# Altium schematic sheet Power.SchDoc
size A3; SheetNumber: 1; SheetTotal: 5
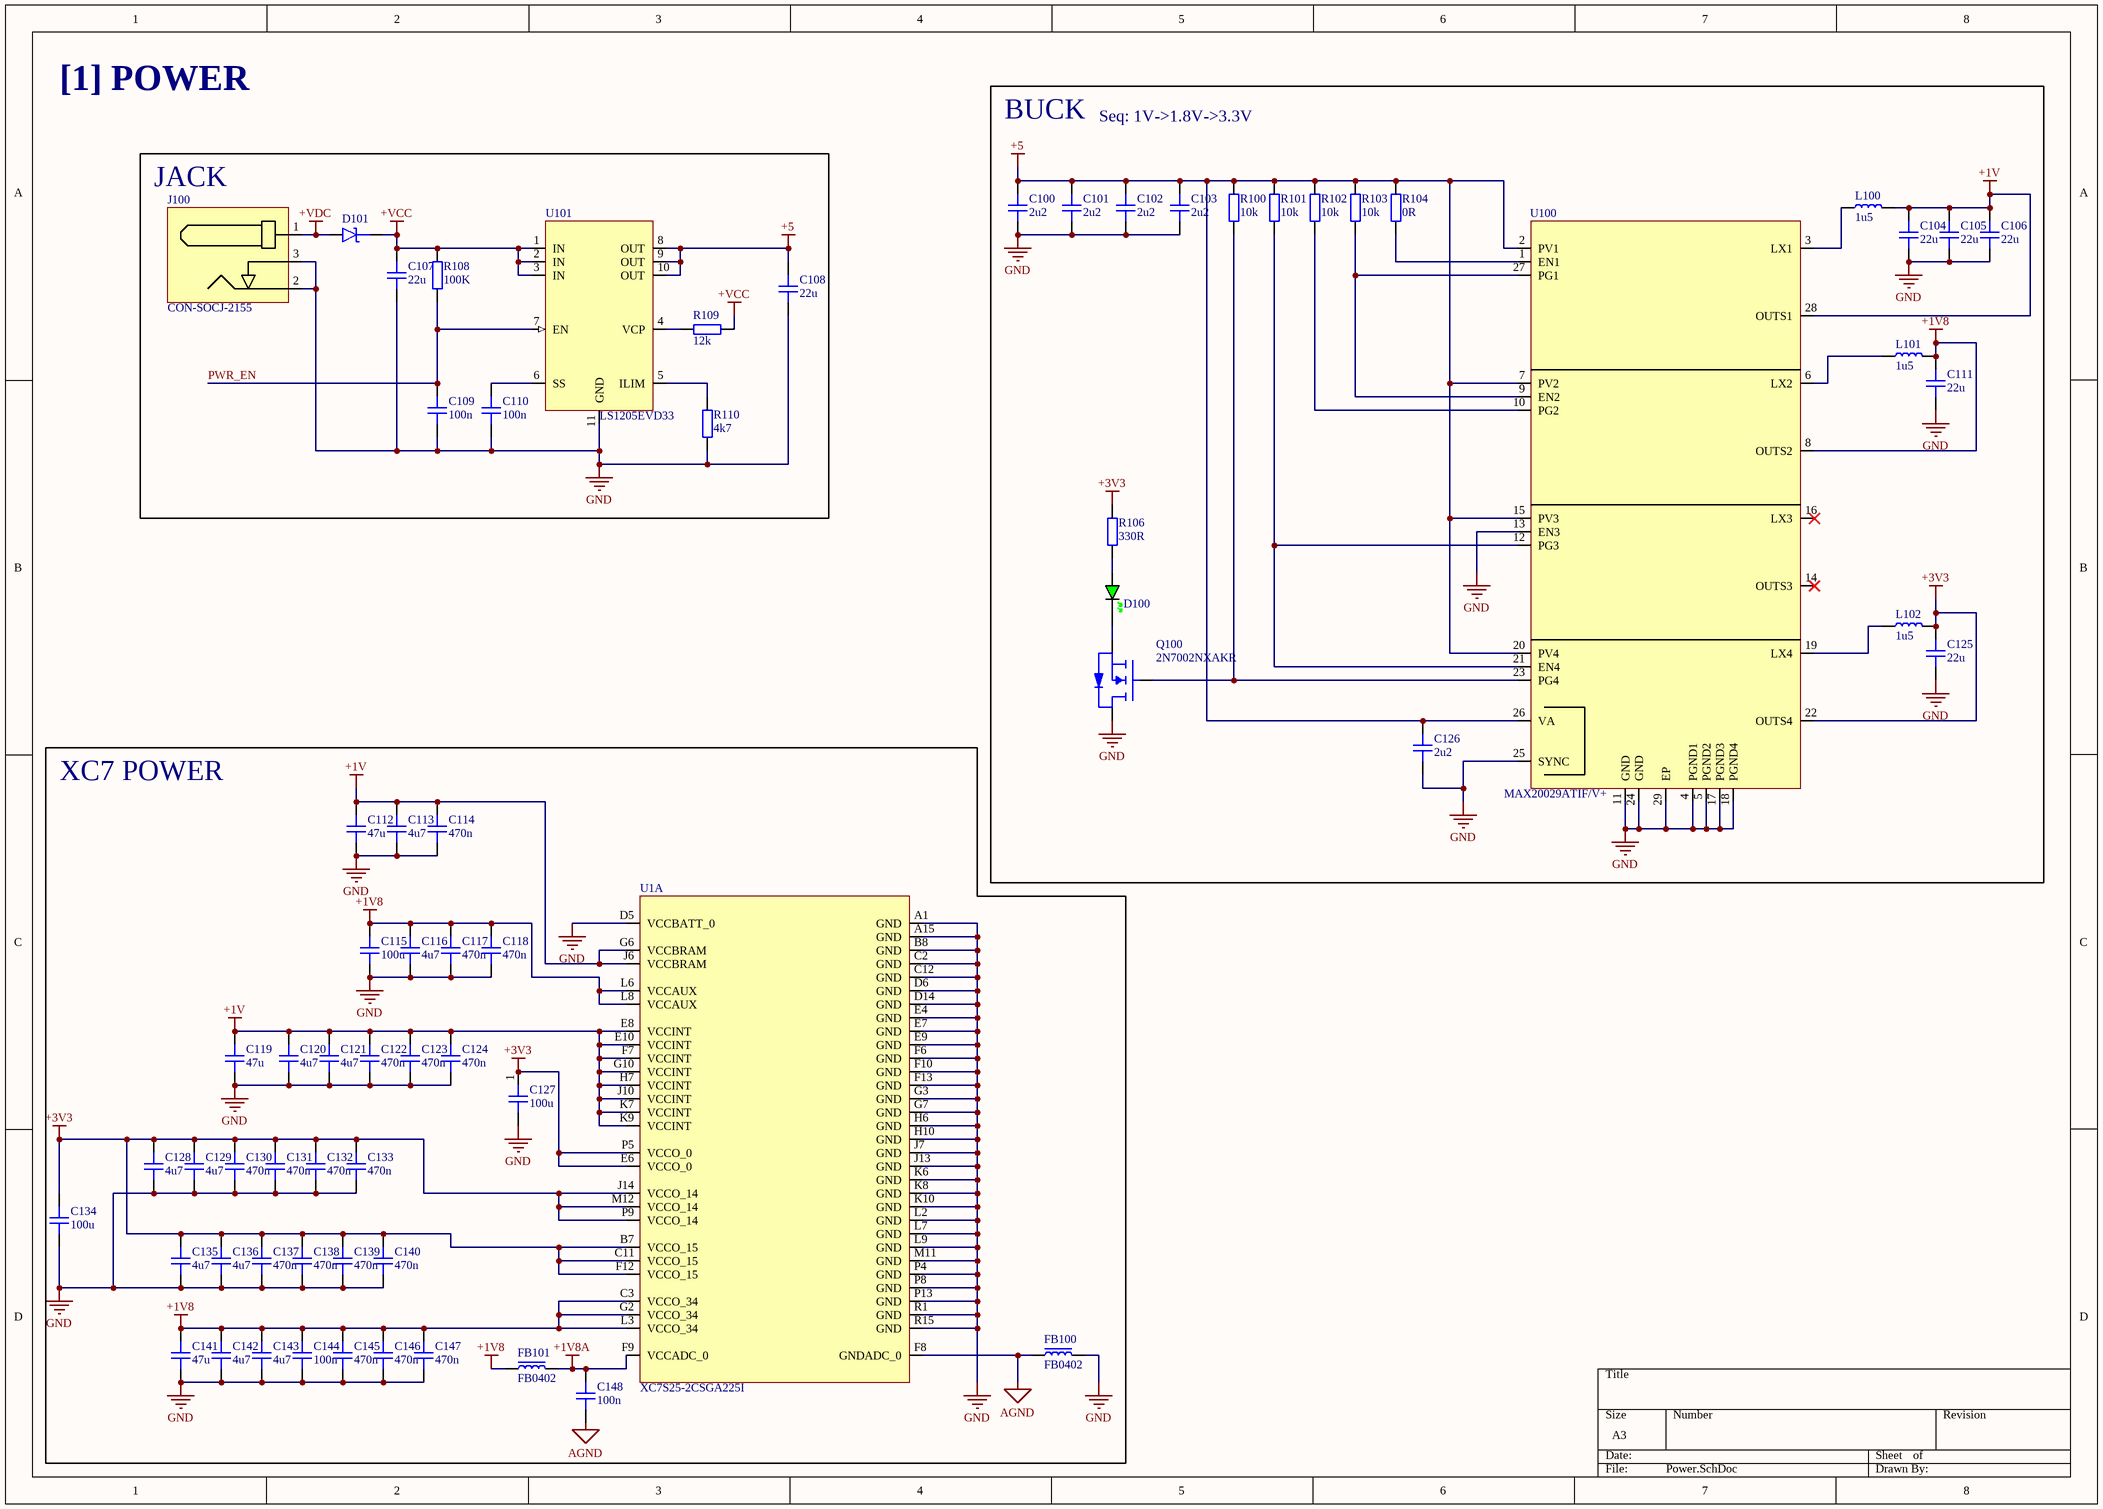
[diagram p0: Power.SchDoc]

## Parts
C100  2u2  [CAP_0603]
C101  2u2  [CAP_0603]
C102  2u2  [CAP_0603]
C103  2u2  [CAP_0603]
C104  22u  [CAP_0402]
C105  22u  [CAP_0402]
C106  22u  [CAP_0402]
C107  22u  [CAP_0402]
C108  22u  [CAP_0402]
C109  100n  [CAP_0402]
C110  100n  [CAP_0402]
C111  22u  [CAP_0402]
C112  47u  [CAP_0805]
C113  4u7  [CAP_0402]
C114  470n  [CAP_0201]
C115  100u  [CAP_0805]
C116  4u7  [CAP_0402]
C117  470n  [CAP_0201]
C118  470n  [CAP_0201]
C119  47u  [CAP_0805]
C120  4u7  [CAP_0402]
C121  4u7  [CAP_0402]
C122  470n  [CAP_0201]
C123  470n  [CAP_0201]
C124  470n  [CAP_0201]
C125  22u  [CAP_0402]
C126  2u2  [CAP_0603]
C127  100u  [CAP_0805]
C128  4u7  [CAP_0402]
C129  4u7  [CAP_0402]
C130  470n  [CAP_0201]
C131  470n  [CAP_0201]
C132  470n  [CAP_0201]
C133  470n  [CAP_0201]
C134  100u  [CAP_0805]
C135  4u7  [CAP_0402]
C136  4u7  [CAP_0402]
C137  470n  [CAP_0201]
C138  470n  [CAP_0201]
C139  470n  [CAP_0201]
C140  470n  [CAP_0201]
C141  47u  [CAP_0805]
C142  4u7  [CAP_0402]
C143  4u7  [CAP_0402]
C144  100n  [CAP_0201]
C145  470n  [CAP_0201]
C146  470n  [CAP_0201]
C147  470n  [CAP_0201]
C148  100n  [CAP_0201]
D100  GREEN  [LED_0402_GREEN]  (value not drawn)
D101  D_SCHOTTKY_SMC  [SMC-DO-214AB]  (value not drawn)
FB100  FB0402  [FB_0402]
FB101  FB0402  [FB_0402]
J100  CON-SOCJ-2155  [CON-SOCJ-2155]
L100  1u5  [MWSA0603S]
L101  1u5  [MWSA0603S]
L102  1u5  [MWSA0603S]
Q100  2N7002NXAKR  [SSM3J338R,LF-SOT23-F]
R100  10k  [RES_0402]
R101  10k  [RES_0402]
R102  10k  [RES_0402]
R103  10k  [RES_0402]
R104  0R  [RES_0402]
R106  330R  [RES_0402]
R108  100K  [RES_0603]
R109  12k  [RES_0402]
R110  4k7  [RES_0402]
U1  XC7S25-2CSGA225I  [CSGA225]  (part A of 5)
U100  MAX20029ATIF/V+  [TQFN-28-5x5-EP]
U101  LS1205EVD33  [DFN3x3_10L]

## Blocks framed on the sheet
BUCK: C100-C106 C111 C125 C126 D100 L100-L102 Q100 R100-R104 R106 U100
JACK: C107-C110 D101 J100 R108-R110 U101
XC7 POWER: C112-C124 C127-C148 FB100 FB101 U1

## Nets
+1V: C104.2 C105.2 C106.2 C112.2 C113.2 C114.2 C119.2 C120.2 C121.2 C122.2 C123.2 C124.2 L100.2 U1.E8(VCCINT) U1.E10(VCCINT) U1.F7(VCCINT) U1.G6(VCCBRAM) U1.G10(VCCINT) U1.H7(VCCINT) U1.J6(VCCBRAM) U1.J10(VCCINT) U1.K7(VCCINT) U1.K9(VCCINT) U100.28(OUTS1)
+1V8: C111.2 C115.2 C116.2 C117.2 C118.2 C141.2 C142.2 C143.2 C144.2 C145.2 C146.2 C147.2 FB101.1 L101.2 U1.C3(VCCO_34) U1.G2(VCCO_34) U1.L3(VCCO_34) U1.L6(VCCAUX) U1.L8(VCCAUX) U100.8(OUTS2)
+1V8A: C148.2 FB101.2 U1.F9(VCCADC_0)
+3V3: C125.2 C127.1 C128.2 C129.2 C130.2 C131.2 C132.2 C133.2 C134.2 C135.2 C136.2 C137.2 C138.2 C139.2 C140.2 L102.2 R106.2 U1.B7(VCCO_15) U1.C11(VCCO_15) U1.E6(VCCO_0) U1.F12(VCCO_15) U1.J14(VCCO_14) U1.M12(VCCO_14) U1.P5(VCCO_0) U1.P9(VCCO_14) U100.22(OUTS4)
+5: C100.2 C101.2 C102.2 C103.2 C108.2 C126.2 R100.2 R101.2 R102.2 R103.2 R104.2 U100.2(PV1) U100.7(PV2) U100.15(PV3) U100.20(PV4) U100.26(VA) U101.8(OUT) U101.9(OUT) U101.10(OUT)
+VCC: C107.2 D101.K R108.2 R109.1 U101.1(IN) U101.2(IN) U101.3(IN)
+VDC: D101.A J100.1
AGND: C148.1 FB100.1 U1.F8(GNDADC_0)
GND: C100.1 C101.1 C102.1 C103.1 C104.1 C105.1 C106.1 C107.1 C108.1 C109.1 C110.1 C111.1 C112.1 C113.1 C114.1 C115.1 C116.1 C117.1 C118.1 C119.1 C120.1 C121.1 C122.1 C123.1 C124.1 C125.1 C126.1 C127.2 C128.1 C129.1 C130.1 C131.1 C132.1 C133.1 C134.1 C135.1 C136.1 C137.1 C138.1 C139.1 C140.1 C141.1 C142.1 C143.1 C144.1 C145.1 C146.1 C147.1 FB100.2 J100.2 J100.3 Q100.D R110.1 U1.A1(GND) U1.A15(GND) U1.B8(GND) U1.C2(GND) U1.C12(GND) U1.D5(VCCBATT_0) U1.D6(GND) U1.D14(GND) U1.E4(GND) U1.E7(GND) U1.E9(GND) U1.F6(GND) U1.F10(GND) U1.F13(GND) U1.G3(GND) U1.G7(GND) U1.H6(GND) U1.H10(GND) U1.J7(GND) U1.J13(GND) U1.K6(GND) U1.K8(GND) U1.K10(GND) U1.L2(GND) U1.L7(GND) U1.L9(GND) U1.M11(GND) U1.P4(GND) U1.P8(GND) U1.P13(GND) U1.R1(GND) U1.R15(GND) U100.4(PGND1) U100.5(PGND2) U100.11(GND) U100.13(EN3) U100.17(PGND3) U100.18(PGND4) U100.24(GND) U100.25(SYNC) U100.29(EP) U101.11(GND)
PWR_EN: C109.2 R108.1 U101.7(EN)
NetC110_2: C110.2 U101.6(SS)
NetD100_A: D100.A R106.1
NetD100_K: D100.K Q100.S
NetL100_1: L100.1 U100.3(LX1)
NetL101_1: L101.1 U100.6(LX2)
NetL102_1: L102.1 U100.19(LX4)
NetQ100_G: Q100.G R100.1 U100.23(PG4)
NetR101_1: R101.1 U100.12(PG3) U100.21(EN4)
NetR102_1: R102.1 U100.10(PG2)
NetR103_1: R103.1 U100.9(EN2) U100.27(PG1)
NetR104_1: R104.1 U100.1(EN1)
NetR109_2: R109.2 U101.4(VCP)
NetR110_2: R110.2 U101.5(ILIM)

Not connected (* = marked no-connect by the designer): U100 14(OUTS3)* 16(LX3)*

## Notes on the sheet
- [1] POWER
- Seq: 1V->1.8V->3.3V

## Library data of the parts
C100-C103 C126 = CAP_0603: Capacitor SMD 0603; Manufacturer: *; Manufacturer Part Number: *; Distributor Link: *; LCSC: *; Rating: *; Dielectric: *
C104-C111 C113 C116 C120 C121 C125 C128 C129 C135 C136 C142 C143 = CAP_0402: Capacitor SMD 0402; Manufacturer: *; Manufacturer Part Number: *; Distributor Link: *; LCSC: *; Rating: *; Dielectric: *
C112 C115 C119 C127 C134 C141 = CAP_0805: Capacitor SMD 0805; Manufacturer: *; Manufacturer Part Number: *; Distributor Link: *; LCSC: *; Rating: *; Dielectric: *
C114 C117 C118 C122-C124 C130-C133 C137-C140 C144-C148 = CAP_0201: Capacitor SMD 0201; Manufacturer: *; Manufacturer Part Number: *; Distributor Link: *; LCSC: *; Rating: *; Dielectric: *
D100 = LED_0402_GREEN: LED 0402 GREEN SMD
D101 = D_SCHOTTKY_SMC: Diode Schottky SMD SMC (DO-214AB); Distributor Link: *
FB100 FB101 = FB_0402: Ferrite Bead SMD 0402; Manufacturer: *; Manufacturer Part Number: *; Distributor Link: *; LCSC: *
J100 = CON-SOCJ-2155: DC Barrell Jack 2.1mm 30V 2.5A THT; Manufacturer: Gravitech; Manufacturer Part Number: CON-SOCJ-2155
L100-L102 = MWSA0603S: Power Inductor SMD Sunlord MWSA0603S; Manufacturer Part Number: MWSA0603S-; Manufacturer: Sunlord
Q100 = 2N7002NXAKR: MOSFET N-Channel Vds=60V Id=300mA with ESD Protection; Manufacturer: Nexperia; Manufacturer Part Number: 2N7002NXAKR
R100-R104 R106 R109 R110 = RES_0402: Resistor SMD 0402; Manufacturer: *; Manufacturer Part Number: *; Distributor Link: *; LCSC: *
R108 = RES_0603: Resistor SMD 0603; Manufacturer: *; Manufacturer Part Number: *; Distributor Link: *; LCSC: *
U1 = XC7S25-2CSGA225I: Field-Programmable Gate Array FPGA Spartan-7 Series CSGA-225 Speed Grade 2 Industrial Temperature Range; Manufacturer: Xilinx; Manufacturer Part Number: XC7S25-2CSGA225I; Distributor Link: https://www.lcsc.com/product-detail/Programmable-Logic-Device-CPLDs-FPGAs_XILINX-XC7S25-2CSGA225I_C1521711.html; LCSC: C1521711
U100 = MAX20029ATIF/V+: Switching Voltage Regulator Buck 4-Channel 700mV to 4V 1.5A TQFN-EP-28; Manufacturer: Maxim Integrated; Manufacturer Part Number: MAX20029ATIF/V+
U101 = LS1205EVD33: 18V, 5A eFuse with Programmable Current Limit and Output Voltage Clamp; Manufacturer: Littelfuse; Manufacturer Part Number: LS1205EVD33